# EAGLE design electroplating (EAGLE 6.5.0)
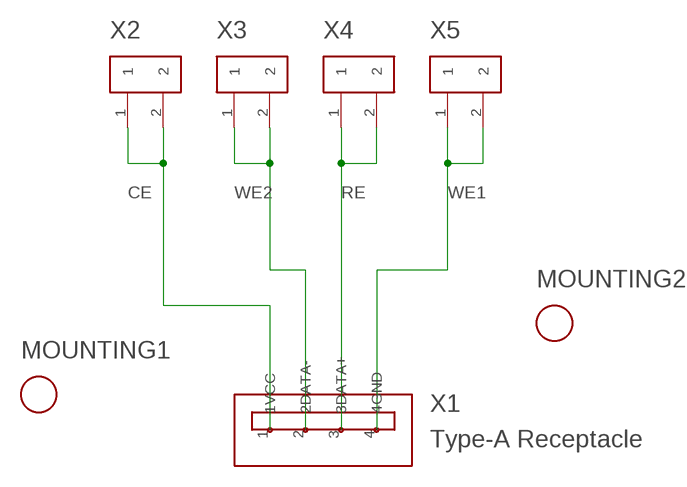
[diagram p0: schematic, sheet 1]

## Parts
MOUNTING1  M2-MOUNTING-HOLE  [M2-MOUNTING-HOLE]
MOUNTING2  M2-MOUNTING-HOLE  [M2-MOUNTING-HOLE]
X1  Type-A Receptacle  USB-TYPE-A-RECEPTACLE  [TE_CONNECTIVITY_292303-1]
X2  2-PIN-CONNECTOR  [2-PIN-HEADER]
X3  2-PIN-CONNECTOR  [2-PIN-HEADER]
X4  2-PIN-CONNECTOR  [2-PIN-HEADER]
X5  2-PIN-CONNECTOR  [2-PIN-HEADER]

## Nets
CE: X1.1(1VCC) X2.1 X2.2
RE: X1.3(3DATA+) X4.1 X4.2
WE1: X1.4(4GND) X5.1 X5.2
WE2: X1.2(2DATA-) X3.1 X3.2

## Library data of the parts
MOUNTING1 MOUNTING2 = sensor-breakout-boards:M2-MOUNTING-HOLE
X1 = sensor-breakout-boards:USB-TYPE-A-RECEPTACLE: USB Type-A Receptacle TE Connectivity Part No. 292303-1 Digi-key Part No. A31726-ND
X2-X5 = sensor-breakout-boards:2-PIN-CONNECTOR: 2-Pin, 0.1", Male Header 3M Part Number: 961102-6404-AR Digi-key Part Number: 3M9447-ND

## Board
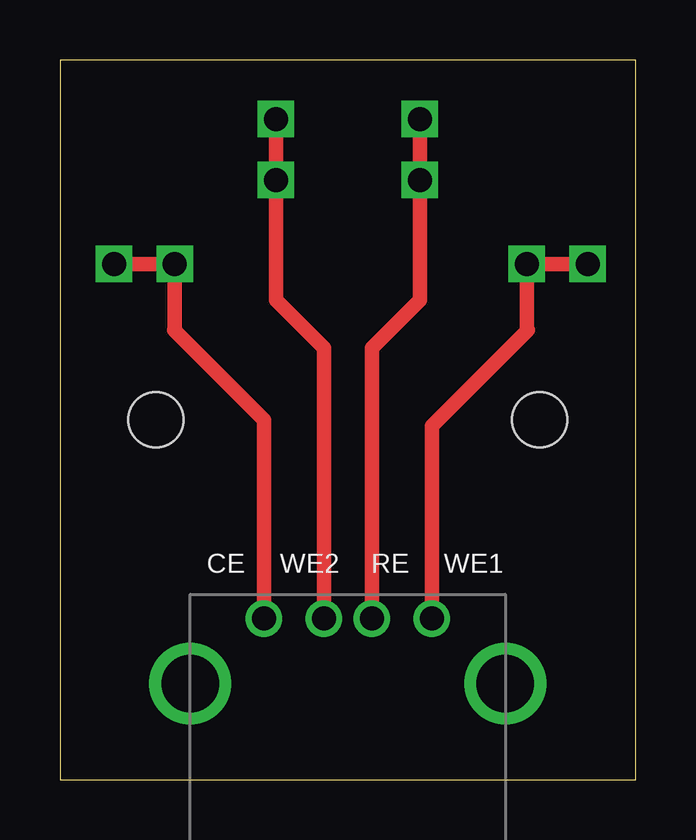
[diagram p1: board, top side]

Size 24 x 30 mm. Coordinates in mm from the lower left corner, seen from the top.
Outline: 0,0 24,0 24,30 0,30 0,0
Copper layers (1*16): Top 0.035mm / dielectric 1.5mm / Bottom 0.035mm
Design rules "default": minimum track width 10mil, minimum drill 24mil, track to track 8mil, track to pad 8mil, pad to pad 8mil, via to via 8mil, smd to smd 8mil, copper to edge 40mil, drill to drill 8mil, minimum pad ring 10mil, minimum via ring 8mil, stop-mask expansion 4mil, vias tented up to drill 0mil, thermal gap 10mil

### Footprints (pad centres in the part's own frame; a part is rotated, then mirrored left to right if it is on the bottom)
M2-MOUNTING-HOLE = hole 2.31: 0,0
TE_CONNECTIVITY_292303-1 = drill 1: 1 -3.5,2.71; 2 -1,2.71; 3 1,2.71; 4 3.5,2.71 | drill 2.4: CHAS@1 -6.57,0; CHAS@2 6.57,0
2-PIN-HEADER = drill 1 square: 1 0,0; 2 2.54,0

### Placement (x,y rotation side)
MOUNTING1  20,15 0 top
MOUNTING2  4,15 0 top
X1  12,4 0 top
X2  2.25,21.5 0 top
X3  9,25 90 top
X4  15,25 90 top
X5  22,21.5 180 top

### Tracks (layer width: path | path; a pad name or v marks a point on that pad's centre or on a via)
CE
  Top 0.61: X1.1 8.5,15 4.75,18.75 4.79,18.75 X2.2 X2.1
RE
  Top 0.61: X4.2 15,25.5 X4.1 15,20 13,18 X1.3
WE1
  Top 0.61: X1.4 15.5,14.75 19.5,18.75 19.46,18.75 X5.2 X5.1
WE2
  Top 0.61: X3.2 X3.1 9,20 11,18 X1.2

### Text on the board
tPlace: CE | WE2 | RE | WE1